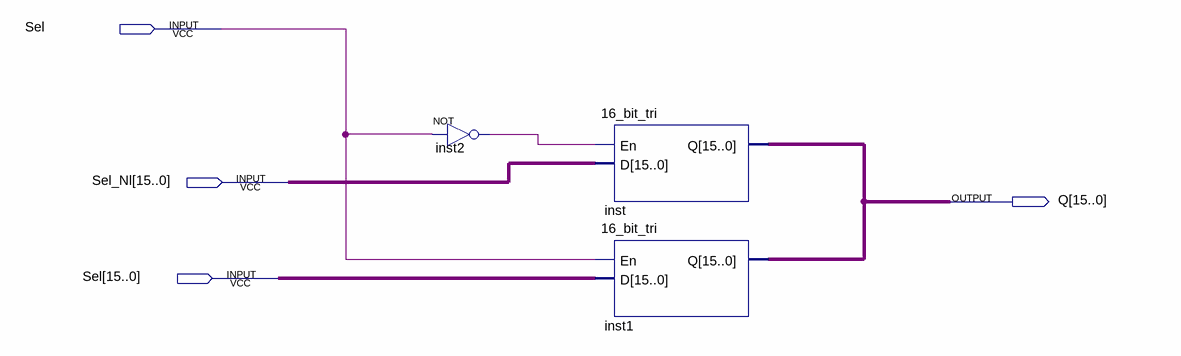
[diagram p0: schematic sheet]
// Quartus schematic 16_bit_1to2.bdf as structural Verilog: 3 symbols, 4 pins
module \16_bit_1to2  (
  input  Sel_1bit,
  input  [15:0] Sel_Nl,
  input  [15:0] Sel,
  output [15:0] Q
);

  wire inst2_out;

  not inst2 (inst2_out, Sel_1bit);
  \16_bit_tri  inst (.En(inst2_out), .D(Sel_Nl), .Q(Q));
  \16_bit_tri  inst1 (.En(Sel_1bit), .D(Sel), .Q(Q));
endmodule
